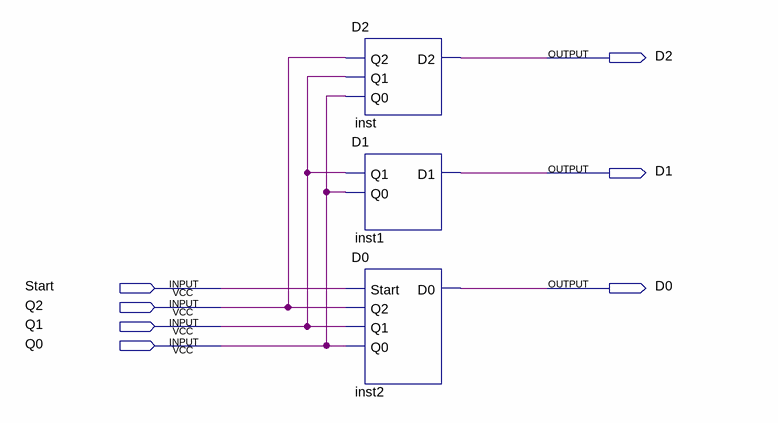
[diagram p0: schematic sheet]
// Quartus schematic D.bdf as structural Verilog: 3 symbols, 7 pins
module D (
  input  Start,
  input  Q2,
  input  Q1,
  input  Q0,
  output D2,
  output D1,
  output D0
);

  D2 inst (.Q2(Q2), .Q1(Q1), .Q0(Q0), .D2(D2));
  D1 inst1 (.Q1(Q1), .Q0(Q0), .D1(D1));
  D0 inst2 (.Start(Start), .Q2(Q2), .Q1(Q1), .Q0(Q0), .D0(D0));
endmodule
